# EasyEDA schematic Projeto PD_2021-02-18_15-49-25.json
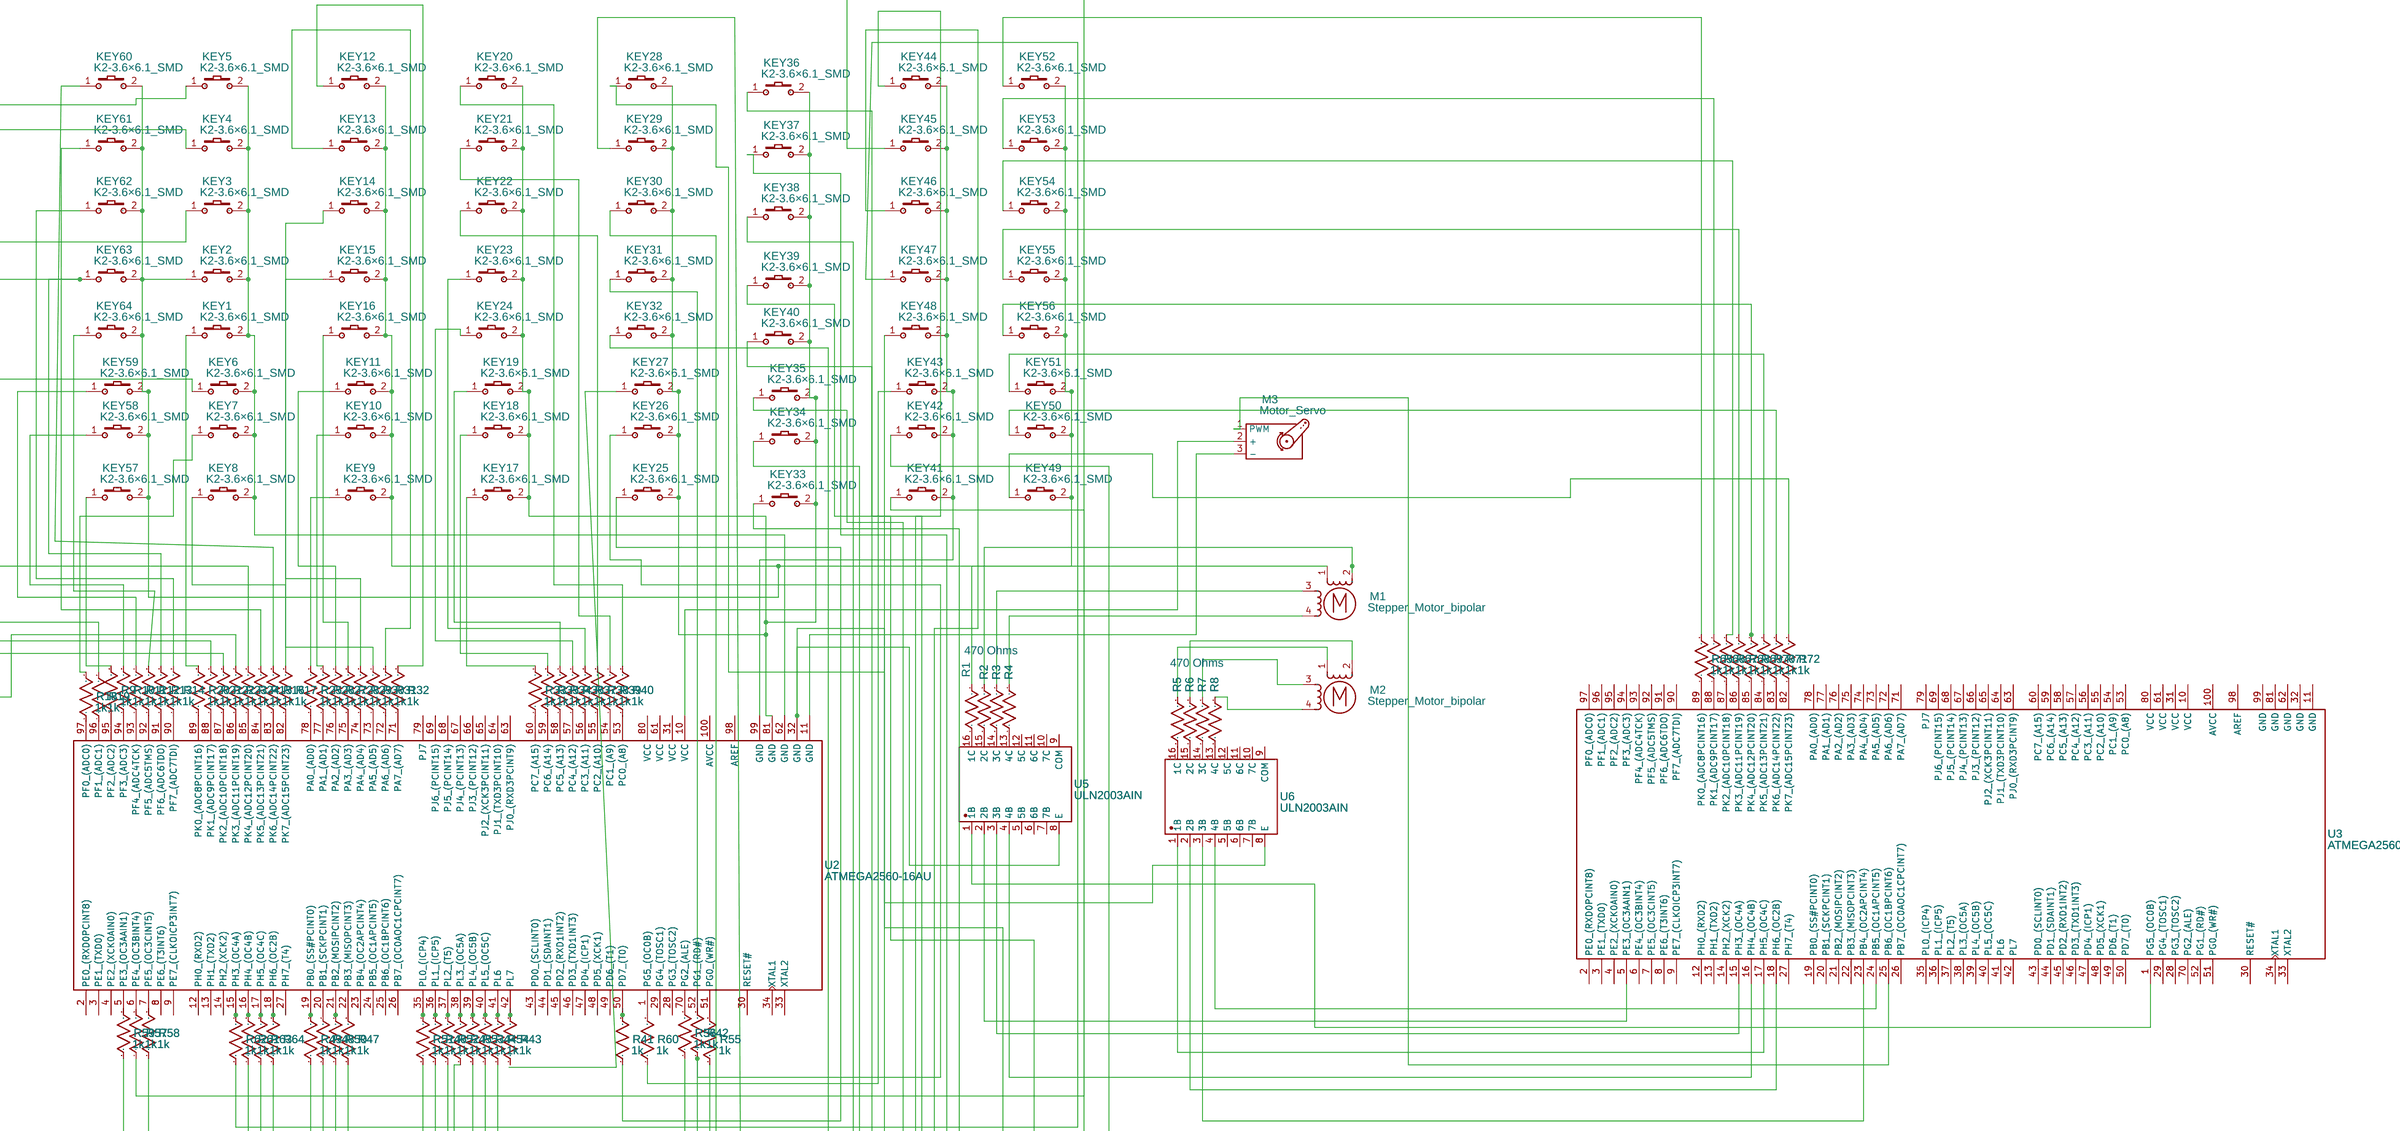
[diagram p0: schematic sheet]

## Parts
KEY1  K2-3.6×6.1_SMD  [KEY-SMD_2P-L6.2-W3.6-LS8.0]
KEY2  K2-3.6×6.1_SMD  [KEY-SMD_2P-L6.2-W3.6-LS8.0]
KEY3  K2-3.6×6.1_SMD  [KEY-SMD_2P-L6.2-W3.6-LS8.0]
KEY4  K2-3.6×6.1_SMD  [KEY-SMD_2P-L6.2-W3.6-LS8.0]
KEY5  K2-3.6×6.1_SMD  [KEY-SMD_2P-L6.2-W3.6-LS8.0]
KEY6  K2-3.6×6.1_SMD  [KEY-SMD_2P-L6.2-W3.6-LS8.0]
KEY7  K2-3.6×6.1_SMD  [KEY-SMD_2P-L6.2-W3.6-LS8.0]
KEY8  K2-3.6×6.1_SMD  [KEY-SMD_2P-L6.2-W3.6-LS8.0]
KEY9  K2-3.6×6.1_SMD  [KEY-SMD_2P-L6.2-W3.6-LS8.0]
KEY10  K2-3.6×6.1_SMD  [KEY-SMD_2P-L6.2-W3.6-LS8.0]
KEY11  K2-3.6×6.1_SMD  [KEY-SMD_2P-L6.2-W3.6-LS8.0]
KEY12  K2-3.6×6.1_SMD  [KEY-SMD_2P-L6.2-W3.6-LS8.0]
KEY13  K2-3.6×6.1_SMD  [KEY-SMD_2P-L6.2-W3.6-LS8.0]
KEY14  K2-3.6×6.1_SMD  [KEY-SMD_2P-L6.2-W3.6-LS8.0]
KEY15  K2-3.6×6.1_SMD  [KEY-SMD_2P-L6.2-W3.6-LS8.0]
KEY16  K2-3.6×6.1_SMD  [KEY-SMD_2P-L6.2-W3.6-LS8.0]
KEY17  K2-3.6×6.1_SMD  [KEY-SMD_2P-L6.2-W3.6-LS8.0]
KEY18  K2-3.6×6.1_SMD  [KEY-SMD_2P-L6.2-W3.6-LS8.0]
KEY19  K2-3.6×6.1_SMD  [KEY-SMD_2P-L6.2-W3.6-LS8.0]
KEY20  K2-3.6×6.1_SMD  [KEY-SMD_2P-L6.2-W3.6-LS8.0]
KEY21  K2-3.6×6.1_SMD  [KEY-SMD_2P-L6.2-W3.6-LS8.0]
KEY22  K2-3.6×6.1_SMD  [KEY-SMD_2P-L6.2-W3.6-LS8.0]
KEY23  K2-3.6×6.1_SMD  [KEY-SMD_2P-L6.2-W3.6-LS8.0]
KEY24  K2-3.6×6.1_SMD  [KEY-SMD_2P-L6.2-W3.6-LS8.0]
KEY25  K2-3.6×6.1_SMD  [KEY-SMD_2P-L6.2-W3.6-LS8.0]
KEY26  K2-3.6×6.1_SMD  [KEY-SMD_2P-L6.2-W3.6-LS8.0]
KEY27  K2-3.6×6.1_SMD  [KEY-SMD_2P-L6.2-W3.6-LS8.0]
KEY28  K2-3.6×6.1_SMD  [KEY-SMD_2P-L6.2-W3.6-LS8.0]
KEY29  K2-3.6×6.1_SMD  [KEY-SMD_2P-L6.2-W3.6-LS8.0]
KEY30  K2-3.6×6.1_SMD  [KEY-SMD_2P-L6.2-W3.6-LS8.0]
KEY31  K2-3.6×6.1_SMD  [KEY-SMD_2P-L6.2-W3.6-LS8.0]
KEY32  K2-3.6×6.1_SMD  [KEY-SMD_2P-L6.2-W3.6-LS8.0]
KEY33  K2-3.6×6.1_SMD  [KEY-SMD_2P-L6.2-W3.6-LS8.0]
KEY34  K2-3.6×6.1_SMD  [KEY-SMD_2P-L6.2-W3.6-LS8.0]
KEY35  K2-3.6×6.1_SMD  [KEY-SMD_2P-L6.2-W3.6-LS8.0]
KEY36  K2-3.6×6.1_SMD  [KEY-SMD_2P-L6.2-W3.6-LS8.0]
KEY37  K2-3.6×6.1_SMD  [KEY-SMD_2P-L6.2-W3.6-LS8.0]
KEY38  K2-3.6×6.1_SMD  [KEY-SMD_2P-L6.2-W3.6-LS8.0]
KEY39  K2-3.6×6.1_SMD  [KEY-SMD_2P-L6.2-W3.6-LS8.0]
KEY40  K2-3.6×6.1_SMD  [KEY-SMD_2P-L6.2-W3.6-LS8.0]
KEY41  K2-3.6×6.1_SMD  [KEY-SMD_2P-L6.2-W3.6-LS8.0]
KEY42  K2-3.6×6.1_SMD  [KEY-SMD_2P-L6.2-W3.6-LS8.0]
KEY43  K2-3.6×6.1_SMD  [KEY-SMD_2P-L6.2-W3.6-LS8.0]
KEY44  K2-3.6×6.1_SMD  [KEY-SMD_2P-L6.2-W3.6-LS8.0]
KEY45  K2-3.6×6.1_SMD  [KEY-SMD_2P-L6.2-W3.6-LS8.0]
KEY46  K2-3.6×6.1_SMD  [KEY-SMD_2P-L6.2-W3.6-LS8.0]
KEY47  K2-3.6×6.1_SMD  [KEY-SMD_2P-L6.2-W3.6-LS8.0]
KEY48  K2-3.6×6.1_SMD  [KEY-SMD_2P-L6.2-W3.6-LS8.0]
KEY49  K2-3.6×6.1_SMD  [KEY-SMD_2P-L6.2-W3.6-LS8.0]
KEY50  K2-3.6×6.1_SMD  [KEY-SMD_2P-L6.2-W3.6-LS8.0]
KEY51  K2-3.6×6.1_SMD  [KEY-SMD_2P-L6.2-W3.6-LS8.0]
KEY52  K2-3.6×6.1_SMD  [KEY-SMD_2P-L6.2-W3.6-LS8.0]
KEY53  K2-3.6×6.1_SMD  [KEY-SMD_2P-L6.2-W3.6-LS8.0]
KEY54  K2-3.6×6.1_SMD  [KEY-SMD_2P-L6.2-W3.6-LS8.0]
KEY55  K2-3.6×6.1_SMD  [KEY-SMD_2P-L6.2-W3.6-LS8.0]
KEY56  K2-3.6×6.1_SMD  [KEY-SMD_2P-L6.2-W3.6-LS8.0]
KEY57  K2-3.6×6.1_SMD  [KEY-SMD_2P-L6.2-W3.6-LS8.0]
KEY58  K2-3.6×6.1_SMD  [KEY-SMD_2P-L6.2-W3.6-LS8.0]
KEY59  K2-3.6×6.1_SMD  [KEY-SMD_2P-L6.2-W3.6-LS8.0]
KEY60  K2-3.6×6.1_SMD  [KEY-SMD_2P-L6.2-W3.6-LS8.0]
KEY61  K2-3.6×6.1_SMD  [KEY-SMD_2P-L6.2-W3.6-LS8.0]
KEY62  K2-3.6×6.1_SMD  [KEY-SMD_2P-L6.2-W3.6-LS8.0]
KEY63  K2-3.6×6.1_SMD  [KEY-SMD_2P-L6.2-W3.6-LS8.0]
KEY64  K2-3.6×6.1_SMD  [KEY-SMD_2P-L6.2-W3.6-LS8.0]
M1  Stepper_Motor_bipolar  [CONN-TH_4P-P2.50_XH-4A]
M2  Stepper_Motor_bipolar  [CONN-TH_4P-P2.50_XH-4A]
M3  Motor_Servo
R1  1k  [R0603]
R2  1k  [R0603]
R3  470  [R0603]
R4  470  [R0603]
R5  470  [R0603]
R6  470  [R0603]
R7  470  [R0603]
R8  470  [R0603]
R9  1k  [R0603]
R10  1k  [R0603]
R11  1k  [R0603]
R12  1k  [R0603]
R13  1k  [R0603]
R14  1k  [R0603]
R15  1k  [R0603]
R16  1k  [R0603]
R17  1k  [R0603]
R18  1k  [R0603]
R19  1k  [R0603]
R20  1k  [R0603]
R21  1k  [R0603]
R22  1k  [R0603]
R23  1k  [R0603]
R24  1k  [R0603]
R25  1k  [R0603]
R26  1k  [R0603]
R27  1k  [R0603]
R28  1k  [R0603]
R29  1k  [R0603]
R30  1k  [R0603]
R31  1k  [R0603]
R32  1k  [R0603]
R33  1k  [R0603]
R34  1k  [R0603]
R35  1k  [R0603]
R36  1k  [R0603]
R37  1k  [R0603]
R38  1k  [R0603]
R39  1k  [R0603]
R40  1k  [R0603]
R41  1k  [R0603]
R42  1k  [R0603]
R43  1k  [R0603]
R44  1k  [R0603]
R45  1k  [R0603]
R46  1k  [R0603]
R47  1k  [R0603]
R48  1k  [R0603]
R49  1k  [R0603]
R50  1k  [R0603]
R51  1k  [R0603]
R52  1k  [R0603]
R53  1k  [R0603]
R54  1k  [R0603]
R55  1k  [R0603]
R56  1k  [R0603]
R57  1k  [R0603]
R58  1k  [R0603]
R59  1k  [R0603]
R60  1k  [R0603]
R61  1k  [R0603]
R62  1k  [R0603]
R63  1k  [R0603]
R64  1k  [R0603]
R65  1k  [R0603]
R66  1k  [R0603]
R67  1k  [R0603]
R68  1k  [R0603]
R69  1k  [R0603]
R70  1k  [R0603]
R71  1k  [R0603]
R72  1k  [R0603]
U2  ATMEGA2560-16AU  [TQFP-100_L14.0-W14.0-P0.50-LS16.0-BL]
U3  ATMEGA2560-16AU  [TQFP-100_L14.0-W14.0-P0.50-LS16.0-BL]
U5  ULN2003AIN  [PDIP-16_L22.1-W6.3-P2.54-LS7.6-BL]
U6  ULN2003AIN  [PDIP-16_L22.1-W6.3-P2.54-LS7.6-BL]

## Library data of the parts
KEY1-KEY64 = K2-3.6×6.1_SMD: Supplier Part: C118141; Supplier: LCSC; Manufacturer Part: K2-1107ST-A4SW-06; Contributor: LCEDA_Lib; 制造商: 韩国韩荣
M1 M2 = Stepper_Motor_bipolar: Contributor: KiCAD; license: https://www.gnu.org/licenses/lgpl-2.1.html
M3 = Motor_Servo: Contributor: KiCAD; license: https://www.gnu.org/licenses/lgpl-2.1.html
R1-R72 = R_0603_US: Contributor: LCEDA_Lib
U2 U3 = ATMEGA2560-16AU: Supplier: LCSC; Manufacturer: MICROCHIP; image: //image.lceda.cn/szlcsc/C22460.jpg; Supplier Part: C22460; SMT Type: Extend; JLCPCB SMD: Yes
U5 U6 = ULN2003AIN: Supplier: LCSC; Supplier Part: C90838; Manufacturer: Texas Instruments; Contributor: LCSC; SMT Type: Extend; JLCPCB SMD: Yes; LCSC Assembly: Yes

## Nets
Net-(KEY1-1): KEY1.1 R20.2
Net-(KEY1-2): KEY1.2 KEY2.2 KEY3.2 KEY4.2 KEY5.2 KEY6.2 KEY7.2 KEY8.2 U2.62(GND)
Net-(KEY2-1): KEY2.1 KEY9.2 KEY10.2 KEY11.2 KEY12.2 KEY13.2 KEY14.2 KEY15.2 KEY16.2 KEY49.2 KEY50.2 KEY51.2 KEY52.2 KEY53.2 KEY54.2 KEY55.2 KEY56.2 KEY57.2 KEY58.2 KEY59.2 KEY60.2 KEY61.2 KEY62.2 KEY63.2 KEY64.2
Net-(KEY3-1): KEY3.1 R22.2
Net-(KEY4-1): KEY4.1 R23.2
Net-(KEY5-1): KEY5.1 R24.2
Net-(KEY6-1): KEY6.1 R19.2
Net-(KEY7-1): KEY7.1 R18.2
Net-(KEY8-1): KEY8.1 R17.2
Net-(KEY9-1): KEY9.1 R25.2
Net-(KEY10-1): KEY10.1 R26.2
Net-(KEY11-1): KEY11.1 R27.2
Net-(KEY12-1): KEY12.1 R32.2
Net-(KEY13-1): KEY13.1 R31.2
Net-(KEY14-1): KEY14.1 R30.2
Net-(KEY15-1): KEY15.1 R29.2
Net-(KEY16-1): KEY16.1 R28.2
Net-(KEY17-1): KEY17.1 R33.2
Net-(KEY17-2): KEY17.2 KEY18.2 KEY19.2 KEY20.2 KEY21.2 KEY22.2 KEY23.2 KEY24.2 KEY25.2 KEY26.2 KEY27.2 KEY28.2 KEY29.2 KEY30.2 KEY31.2 KEY32.2 KEY33.2 KEY34.2 KEY35.2 KEY36.2 KEY37.2 KEY38.2 KEY39.2 KEY40.2 U2.81(GND)
Net-(KEY18-1): KEY18.1 R35.2
Net-(KEY19-1): KEY19.1 R34.2
Net-(KEY20-1): KEY20.1 R40.2
Net-(KEY21-1): KEY21.1 R39.2
Net-(KEY22-1): KEY22.1 R38.2
Net-(KEY23-1): KEY23.1 R37.2
Net-(KEY24-1): KEY24.1 R36.2
Net-(KEY25-1): KEY25.1 R41.1
Net-(KEY26-1): KEY26.1 R42.1 R44.1
Net-(KEY28-1): KEY28.1 R48.1
Net-(KEY29-1): KEY29.1 R46.1
Net-(KEY30-1): KEY30.1 R45.1
Net-(KEY31-1): KEY31.1 R42.2
Net-(KEY32-1): KEY32.1 R47.1
Net-(KEY33-1): KEY33.1 R49.1
Net-(KEY34-1): KEY34.1 R50.1
Net-(KEY35-1): KEY35.1 R51.1
Net-(KEY36-1): KEY36.1 R55.1
Net-(KEY37-1): KEY37.1 R56.1
Net-(KEY38-1): KEY38.1 R54.1
Net-(KEY39-1): KEY39.1 R53.1
Net-(KEY40-1): KEY40.1 R52.1
Net-(KEY41-1): KEY41.1 R57.1
Net-(KEY41-2): KEY41.2 KEY42.2 KEY43.2 KEY44.2 KEY45.2 KEY46.2 KEY47.2 KEY48.2 U2.99(GND)
Net-(KEY42-1): KEY42.1 R58.1
Net-(KEY43-1): KEY43.1 R60.1
Net-(KEY44-1): KEY44.1 R64.1
Net-(KEY45-1): KEY45.1 R63.1
Net-(KEY46-1): KEY46.1 R61.1
Net-(KEY47-1): KEY47.1 R62.1
Net-(KEY48-1): KEY48.1 R59.1
Net-(KEY49-1): KEY49.1 R72.2
Net-(KEY50-1): KEY50.1 R71.2
Net-(KEY51-1): KEY51.1 R70.2
Net-(KEY52-1): KEY52.1 R65.2
Net-(KEY53-1): KEY53.1 R66.2
Net-(KEY54-1): KEY54.1 R67.2
Net-(KEY55-1): KEY55.1 R68.2
Net-(KEY56-1): KEY56.1 R69.2
Net-(KEY57-1): KEY57.1 R9.2
Net-(KEY58-1): KEY58.1 R10.2
Net-(KEY59-1): KEY59.1 R11.2
Net-(KEY60-1): KEY60.1 R16.2
Net-(KEY61-1): KEY61.1 R15.2
Net-(KEY62-1): KEY62.1 R14.2
Net-(KEY63-1): KEY63.1 R13.2 R21.2
Net-(KEY64-1): KEY64.1 R12.2
Net-(M1-1): M1.1 R1.2
Net-(M1-2): M1.2 R2.2
Net-(M1-3): M1.3 R3.2
Net-(M1-4): M1.4 R4.2
Net-(M2-1): M2.1 R5.2
Net-(M2-2): M2.2 R6.2
Net-(M2-3): M2.3 R7.2
Net-(M2-4): M2.4 R8.2
Net-(M3-1): M3.1(PWM) U3.25(PB6 (OC1BPCINT6))
Net-(M3-2): M3.2(+) U2.10(VCC)
Net-(M3-3): M3.3(-) U2.11(GND)
Net-(R1-1): R1.1 U5.16(1C)
Net-(R2-1): R2.1 U5.15(2C)
Net-(R3-1): R3.1 U5.14(3C)
Net-(R4-1): R4.1 U5.13(4C)
Net-(R5-1): R5.1 U6.16(1C)
Net-(R6-1): R6.1 U6.15(2C)
Net-(R7-1): R7.1 U6.14(3C)
Net-(R8-1): R8.1 U6.13(4C)
Net-(R9-1): R9.1 U2.95(PF2 (ADC2))
Net-(R10-1): R10.1 U2.94(PF3 (ADC3))
Net-(R11-1): R11.1 U2.93(PF4 (ADC4TCK))
Net-(R12-1): R12.1 U2.92(PF5 (ADC5TMS))
Net-(R13-1): R13.1 U2.91(PF6 (ADC6TDO))
Net-(R14-1): R14.1 U2.90(PF7 (ADC7TDI))
Net-(R15-1): R15.1 U2.84(PK5 (ADC13PCINT21))
Net-(R16-1): R16.1 U2.83(PK6 (ADC14PCINT22))
Net-(R17-1): R17.1 U2.82(PK7 (ADC15PCINT23))
Net-(R20-1): R20.1 U2.89(PK0 (ADC8PCINT16))
Net-(R21-1): R21.1 U2.88(PK1 (ADC9PCINT17))
Net-(R22-1): R22.1 U2.87(PK2 (ADC10PCINT18))
Net-(R23-1): R23.1 U2.86(PK3 (ADC11PCINT19))
Net-(R24-1): R24.1 U2.85(PK4 (ADC12PCINT20))
Net-(R25-1): R25.1 U2.78(PA0 (AD0))
Net-(R26-1): R26.1 U2.77(PA1 (AD1))
Net-(R27-1): R27.1 U2.76(PA2 (AD2))
Net-(R28-1): R28.1 U2.75(PA3 (AD3))
Net-(R29-1): R29.1 U2.74(PA4 (AD4))
Net-(R30-1): R30.1 U2.73(PA5 (AD5))
Net-(R31-1): R31.1 U2.72(PA6 (AD6))
Net-(R32-1): R32.1 U2.71(PA7 (AD7))
Net-(R33-1): R33.1 U2.60(PC7 (A15))
Net-(R34-1): R34.1 U2.58(PC5 (A13))
Net-(R35-1): R35.1 U2.59(PC6 (A14))
Net-(R36-1): R36.1 U2.57(PC4 (A12))
Net-(R37-1): R37.1 U2.56(PC3 (A11))
Net-(R38-1): R38.1 U2.55(PC2 (A10))
Net-(R39-1): R39.1 U2.54(PC1 (A9))
Net-(R40-1): R40.1 U2.53(PC0 (A8))
Net-(R41-2): R41.2 U2.50(PD7 (T0))
Net-(R43-2): R43.2 U2.42(PL7)
Net-(R44-2): R44.2 U2.40(PL5 (OC5C))
Net-(R45-2): R45.2 U2.38(PL3 (OC5A))
Net-(R46-2): R46.2 U2.36(PL1 (ICP5))
Net-(R47-2): R47.2 U2.22(PB3 (MISOPCINT3))
Net-(R48-2): R48.2 U2.20(PB1 (SCKPCINT1))
Net-(R49-2): R49.2 U2.19(PB0 (SS#PCINT0))
Net-(R50-2): R50.2 U2.21(PB2 (MOSIPCINT2))
Net-(R51-2): R51.2 U2.35(PL0 (ICP4))
Net-(R52-2): R52.2 U2.37(PL2 (T5))
Net-(R53-2): R53.2 U2.39(PL4 (OC5B))
Net-(R54-2): R54.2 U2.41(PL6)
Net-(R55-2): R55.2 U2.51(PG0 (WR#))
Net-(R58-2): R58.2 U2.7(PE5 (OC3CINT5))
Net-(R60-2): R60.2 U2.1(PG5 (OC0B))
Net-(R61-2): R61.2 U2.16(PH4 (OC4B))
Net-(R62-2): R62.2 U2.15(PH3 (OC4A))
Net-(R63-2): R63.2 U2.17(PH5 (OC4C))
Net-(R64-2): R64.2 U2.18(PH6 (OC2B))
Net-(R65-1): R65.1 U3.89(PK0 (ADC8PCINT16))
Net-(R66-1): R66.1 U3.88(PK1 (ADC9PCINT17))
Net-(R67-1): R67.1 U3.87(PK2 (ADC10PCINT18))
Net-(R68-1): R68.1 U3.86(PK3 (ADC11PCINT19))
Net-(R69-1): R69.1 U3.85(PK4 (ADC12PCINT20))
Net-(R70-1): R70.1 U3.84(PK5 (ADC13PCINT21))
Net-(R71-1): R71.1 U3.83(PK6 (ADC14PCINT22))
Net-(R72-1): R72.1 U3.82(PK7 (ADC15PCINT23))
Net-(U2-32): U2.32(GND) U5.8(E) U6.8(E)
Net-(U3-1): U3.1(PG5 (OC0B)) U5.1(1B)
Net-(U3-5): U3.5(PE3 (OC3AAIN1)) U5.2(2B)
Net-(U3-15): U3.15(PH3 (OC4A)) U5.3(3B)
Net-(U3-16): U3.16(PH4 (OC4B)) U5.4(4B)
Net-(U3-17): U3.17(PH5 (OC4C)) U6.1(1B)
Net-(U3-18): U3.18(PH6 (OC2B)) U6.2(2B)
Net-(U3-23): U3.23(PB4 (OC2APCINT4)) U6.3(3B)
Net-(U3-24): U3.24(PB5 (OC1APCINT5)) U6.4(4B)

Not connected (* = marked no-connect by the designer): KEY27 1; R18 1; R19 1; R43 1; R56 2; R57 2; R59 2; U2 2(PE0 (RXD0PCINT8)) 3(PE1 (TXD0)) 4(PE2 (XCK0AIN0)) 5(PE3 (OC3AAIN1)) 6(PE4 (OC3BINT4)) 8(PE6 (T3INT6)) 9(PE7 (CLKOICP3INT7)) 12(PH0 (RXD2)) 13(PH1 (TXD2)) 14(PH2 (XCK2)) 23(PB4 (OC2APCINT4)) 24(PB5 (OC1APCINT5)) 25(PB6 (OC1BPCINT6)) 26(PB7 (OC0AOC1CPCINT7)) 27(PH7 (T4)) 28(PG3 (TOSC2)) 29(PG4 (TOSC1)) 30(RESET#) 31(VCC) 33(XTAL2) 34(XTAL1) 43(PD0 (SCLINT0)) 44(PD1 (SDAINT1)) 45(PD2 (RXD1INT2)) 46(PD3 (TXD1INT3)) 47(PD4 (ICP1)) 48(PD5 (XCK1)) 49(PD6 (T1)) 52(PG1 (RD#)) 61(VCC) 63(PJ0 (RXD3PCINT9)) 64(PJ1 (TXD3PCINT10)) 65(PJ2 (XCK3PCINT11)) 66(PJ3 (PCINT12)) 67(PJ4 (PCINT13)) 68(PJ5 (PCINT14)) 69(PJ6 (PCINT15)) 70(PG2 (ALE)) 79(PJ7) 80(VCC) 96(PF1 (ADC1)) 97(PF0 (ADC0)) 98(AREF) 100(AVCC); U3 2(PE0 (RXD0PCINT8)) 3(PE1 (TXD0)) 4(PE2 (XCK0AIN0)) 6(PE4 (OC3BINT4)) 7(PE5 (OC3CINT5)) 8(PE6 (T3INT6)) 9(PE7 (CLKOICP3INT7)) 10(VCC) 11(GND) 12(PH0 (RXD2)) 13(PH1 (TXD2)) 14(PH2 (XCK2)) 19(PB0 (SS#PCINT0)) 20(PB1 (SCKPCINT1)) 21(PB2 (MOSIPCINT2)) 22(PB3 (MISOPCINT3)) 26(PB7 (OC0AOC1CPCINT7)) 27(PH7 (T4)) 28(PG3 (TOSC2)) 29(PG4 (TOSC1)) 30(RESET#) 31(VCC) 32(GND) 33(XTAL2) 34(XTAL1) 35(PL0 (ICP4)) 36(PL1 (ICP5)) 37(PL2 (T5)) 38(PL3 (OC5A)) 39(PL4 (OC5B)) 40(PL5 (OC5C)) 41(PL6) 42(PL7) 43(PD0 (SCLINT0)) 44(PD1 (SDAINT1)) 45(PD2 (RXD1INT2)) 46(PD3 (TXD1INT3)) 47(PD4 (ICP1)) 48(PD5 (XCK1)) 49(PD6 (T1)) 50(PD7 (T0)) 51(PG0 (WR#)) 52(PG1 (RD#)) 53(PC0 (A8)) 54(PC1 (A9)) 55(PC2 (A10)) 56(PC3 (A11)) 57(PC4 (A12)) 58(PC5 (A13)) 59(PC6 (A14)) 60(PC7 (A15)) 61(VCC) 62(GND) 63(PJ0 (RXD3PCINT9)) 64(PJ1 (TXD3PCINT10)) 65(PJ2 (XCK3PCINT11)) 66(PJ3 (PCINT12)) 67(PJ4 (PCINT13)) 68(PJ5 (PCINT14)) 69(PJ6 (PCINT15)) 70(PG2 (ALE)) 71(PA7 (AD7)) 72(PA6 (AD6)) 73(PA5 (AD5)) 74(PA4 (AD4)) 75(PA3 (AD3)) 76(PA2 (AD2)) 77(PA1 (AD1)) 78(PA0 (AD0)) 79(PJ7) 80(VCC) 81(GND) 90(PF7 (ADC7TDI)) 91(PF6 (ADC6TDO)) 92(PF5 (ADC5TMS)) 93(PF4 (ADC4TCK)) 94(PF3 (ADC3)) 95(PF2 (ADC2)) 96(PF1 (ADC1)) 97(PF0 (ADC0)) 98(AREF) 99(GND) 100(AVCC); U5 5(5B) 6(6B) 7(7B) 9(COM) 10(7C) 11(6C) 12(5C); U6 5(5B) 6(6B) 7(7B) 9(COM) 10(7C) 11(6C) 12(5C)

## Notes on the sheet
- 470 Ohms
- 470 Ohms
- R1
